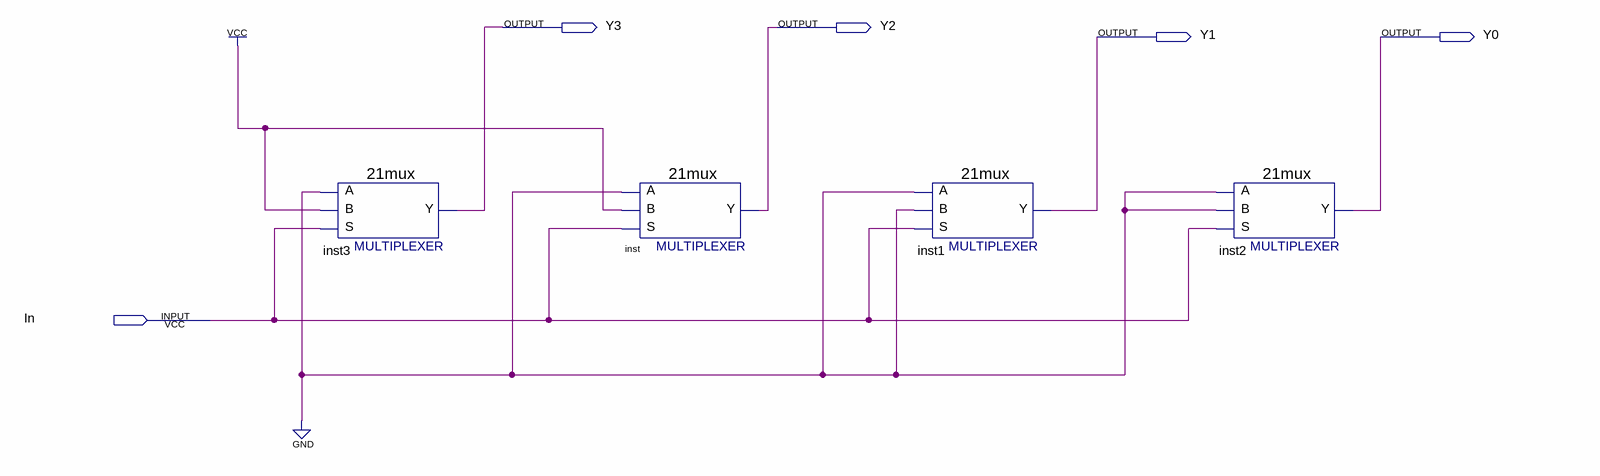
[diagram p0: schematic sheet]
// Quartus schematic OC_If.bdf as structural Verilog: 4 symbols, 5 pins
module OC_If (
  input  In,
  output Y3,
  output Y2,
  output Y1,
  output Y0
);

  \21mux  inst3 (.S(In), .B(1'b1), .A(1'b0), .Y(Y3));
  \21mux  inst (.S(In), .B(1'b1), .A(1'b0), .Y(Y2));
  \21mux  inst1 (.S(In), .B(1'b0), .A(1'b0), .Y(Y1));
  \21mux  inst2 (.S(In), .B(1'b0), .A(1'b0), .Y(Y0));
endmodule
